# EasyEDA schematic SCH_FG Command Controller_2021-10-20.json
TITLE: ESQUEMA ELETRÔNICO PJ; REV: 1.0; Date: 2018-06-01; Sheet: 1/1; Drawn By: Rubens S e Marcos S
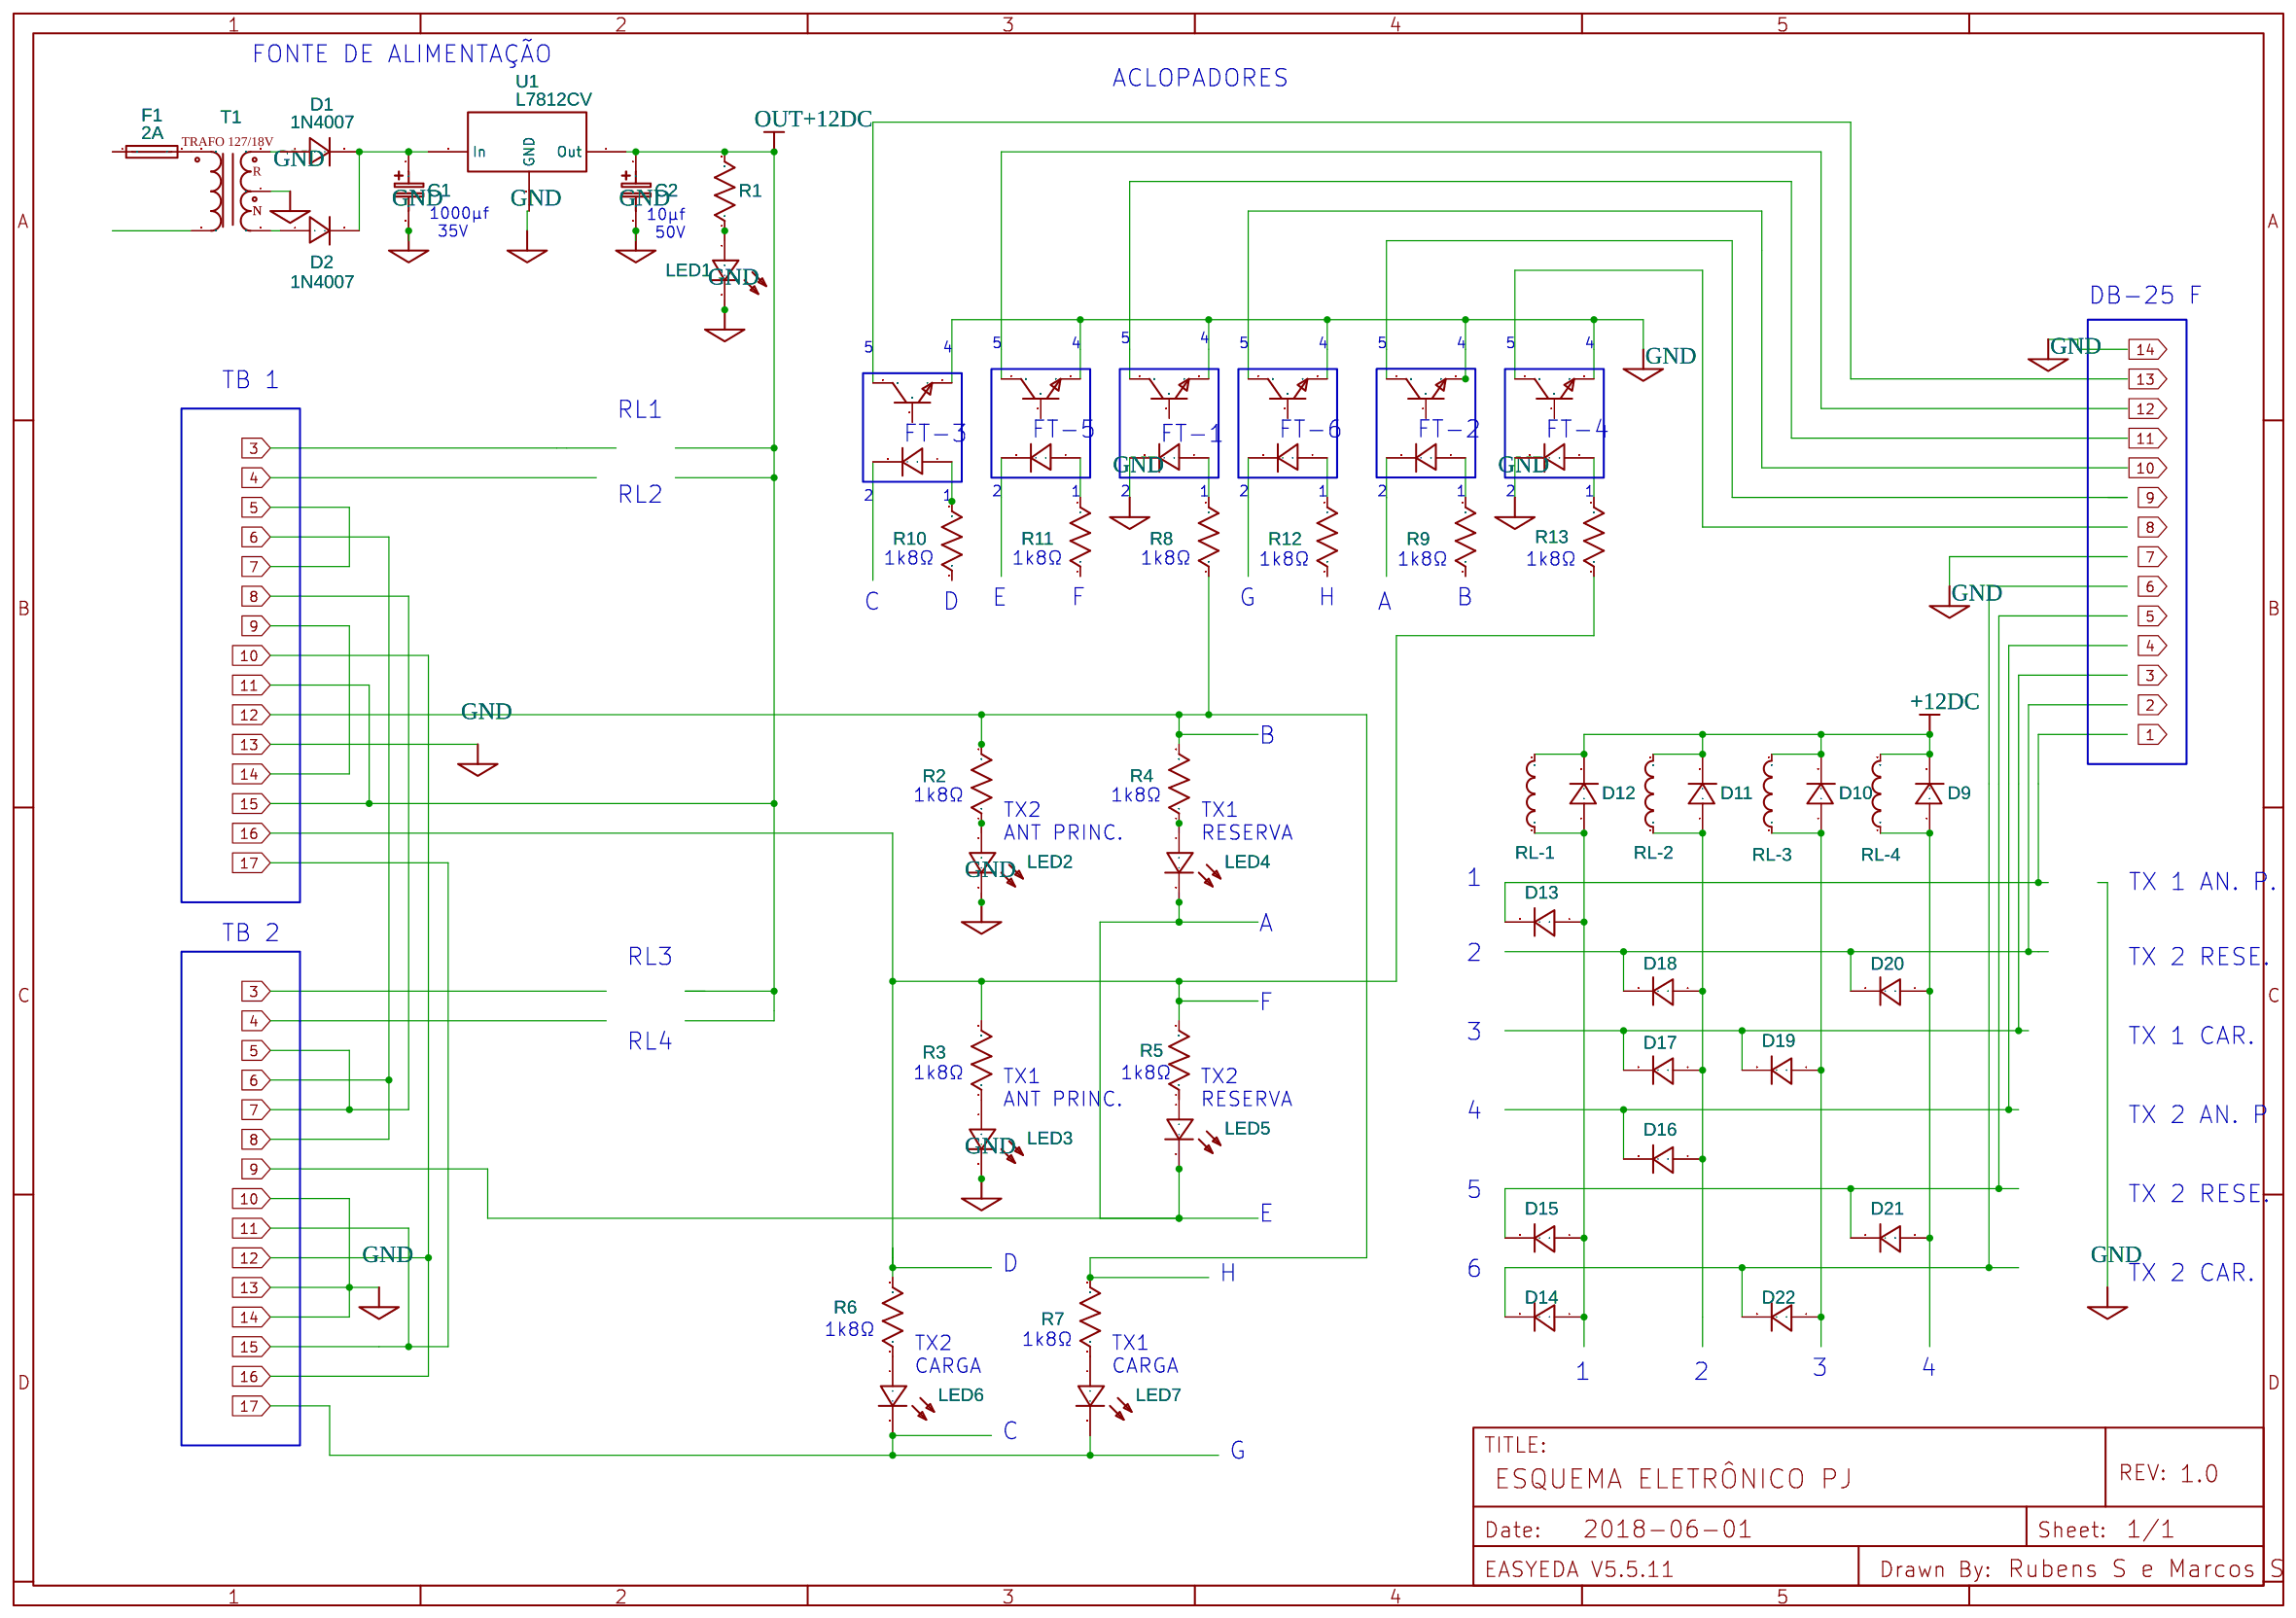
[diagram p0: schematic sheet]

## Parts
6  MMBT5551  [SOT-23(SOT-23-3)]
C1  1u  [CAP-D3.0XF1.5]
C2  1u  [CAP-D3.0XF1.5]
D1  1N4007  [DO35-10]
D2  1N4007  [DO35-10]
D3  1N4148  [DO35-10]
D4  1N4148  [DO35-10]
D5  1N4148  [DO35-10]
D6  1N4148  [DO35-10]
D7  1N4148  [DO35-10]
D8  1N4148  [DO35-10]
D9  1N4148  [DO35-10]
D10  1N4148  [DO35-10]
D11  1N4148  [DO35-10]
D12  1N4148  [DO35-10]
D13  1N4148  [DO35-10]
D14  1N4148  [DO35-10]
D15  1N4148  [DO35-10]
D16  1N4148  [DO35-10]
D17  1N4148  [DO35-10]
D18  1N4148  [DO35-10]
D19  1N4148  [DO35-10]
D20  1N4148  [DO35-10]
D21  1N4148  [DO35-10]
D22  1N4148  [DO35-10]
F1  2A  [2A-3F-250VAC]
LED1  LED 3MM  [LED-3MM/2.54]
LED2  NO  [LED-3MM/2.54]
LED3  LED 3MM  [LED-3MM/2.54]
LED4  LED 3MM  [LED-3MM/2.54]
LED5  LED 3MM  [LED-3MM/2.54]
LED6  LED 3MM  [LED-3MM/2.54]
LED7  LED 3MM  [LED-3MM/2.54]
Q1  MMBT5551  [SOT-23(SOT-23-3)]
Q3  MMBT5551  [SOT-23(SOT-23-3)]
Q4  MMBT5551  [SOT-23(SOT-23-3)]
Q5  MMBT5551  [SOT-23(SOT-23-3)]
Q6  MMBT5551  [SOT-23(SOT-23-3)]
R1  1k  [AXIAL-0.3]
R2  1k  [AXIAL-0.3]
R3  1k  [AXIAL-0.3]
R4  1k  [AXIAL-0.3]
R5  1k  [AXIAL-0.3]
R6  1k  [AXIAL-0.3]
R7  1k  [AXIAL-0.3]
R8  1k  [AXIAL-0.3]
R9  1k  [AXIAL-0.3]
R10  1k  [AXIAL-0.3]
R11  1k  [AXIAL-0.3]
R12  1k  [AXIAL-0.3]
R13  1k  [AXIAL-0.3]
RL-1  1m  [AXIAL-0.4]
RL-2  1m  [AXIAL-0.4]
RL-3  1m  [AXIAL-0.4]
RL-4  1m  [AXIAL-0.4]
T1  XFMR_TAP  [TRANSFORMER 2 TO 3]
U1  L7812CV  [SOT-223]

## Library data of the parts
6 Q1 Q3-Q6 = -: Supplier: LCSC; Manufacturer: CJ; image: http://image.lceda.cn/szlcsc/C28088.jpg; Supplier Part: C28088
C1 C2 = Capacitor: Manufacturer Part: ?
D1-D22 = -: Manufacturer Part: ?
F1 = -: Supplier: LCSC; Manufacturer Part: Glass tube fuse2A 3F 250VAC; Manufacturer: XCFuse; image: http://image.lceda.cn/szlcsc/C71017.jpg; Supplier Part: C71017
LED1-LED7 = -: Supplier: LCSC; Manufacturer: EVERLIGHT; Manufacturer Part: 204-10UYC/S530-A3
R1-R13 = Res_AXIAL-0.3(1/8W)_US: Manufacturer Part: ?
RL-1-RL-4 = Inductor: Manufacturer Part: ?
T1 = -: RATIO: 2; Manufacturer Part: ?
U1 = -: sourceId: dwIGgezVh; Supplier: LCSC; Manufacturer: AMS; Manufacturer Part: AMS1117-3.3; LCSC Assembly: Yes; image: http://image.lceda.cn/szlcsc/C6186.jpg; Supplier Part: C6186

## Nets
10: 6.3(E) C1.2 C2.2 D5.2(-) D8.2(-) LED1.2(-) LED2.2(-) LED3.2(-) LED4.2(-) LED5.2(-) Q1.3(E) Q3.3(E) Q4.3(E) Q5.3(E) Q6.3(E) R2.2 R3.2 R4.2 R5.2 R6.2 R7.2 R8.1 R13.1 T1.4 U1.1(GND)
11: C2.1 LED6.2(-) LED7.2(-) R1.2 U1.2(Out)
+12DC: D9.2(-) D10.2(-) D11.2(-) D12.2(-) RL-1.2 RL-2.2 RL-3.2 RL-4.2
Net-(C1-1): C1.1 D1.2(-) D2.2(-) U1.3(In)
Net-(D1-1): D1.1(+) T1.5
Net-(D2-1): D2.1(+) T1.3
Net-(D3-1): D3.1(+) R12.2
Net-(D4-1): D4.1(+) R11.2
Net-(D5-1): D5.1(+) R13.2
Net-(D6-1): D6.1(+) R10.2
Net-(D7-1): D7.1(+) R9.2
Net-(D8-1): D8.1(+) R8.2
Net-(D9-1): D9.1(+) D20.1(+) D21.1(+) RL-4.1
Net-(D10-1): D10.1(+) D19.1(+) D22.1(+) RL-3.1
Net-(D11-1): D11.1(+) D16.1(+) D17.1(+) D18.1(+) RL-2.1
Net-(D12-1): D12.1(+) D13.1(+) D14.1(+) D15.1(+) RL-1.1
Net-(D14-2): D14.2(-) D22.2(-)
Net-(D15-2): D15.2(-) D21.2(-)
Net-(D17-2): D17.2(-) D19.2(-)
Net-(D18-2): D18.2(-) D20.2(-)
Net-(F1-2): F1.2 T1.1
Net-(LED1-1): LED1.1(+) R1.1
Net-(LED2-1): LED2.1(+) R2.1
Net-(LED3-1): LED3.1(+) R3.1
Net-(LED4-1): LED4.1(+) R4.1
Net-(LED5-1): LED5.1(+) R5.1
Net-(LED6-1): LED6.1(+) R6.1
Net-(LED7-1): LED7.1(+) R7.1

Not connected (* = marked no-connect by the designer): 6 1(B) 2(C); D3 2(-); D4 2(-); D6 2(-); D7 2(-); D13 2(-); D16 2(-); F1 1; Q1 1(B) 2(C); Q3 1(B) 2(C); Q4 1(B) 2(C); Q5 1(B) 2(C); Q6 1(B) 2(C); R9 1; R10 1; R11 1; R12 1; T1 2

## Notes on the sheet
- FONTE DE ALIMENTAÇÃO
- ACLOPADORES
- 1000µf
   35V
- 10µf
   50V
- DB-25 F
- 5
- 4
- 5
- 4
- 5
- 4
- 5
- 4
- 5
- 4
- 5
- 4
- TB 1
- RL1
- FT-5
- FT-6
- FT-2
- FT-4
- FT-3
- FT-1
- RL2
- 2
- 1
- 2
- 1
- 2
- 1
- 2
- 1
- 2
- 1
- 2
- 1
- 1k8Ω
- 1k8Ω
- 1k8Ω
- 1k8Ω
- 1k8Ω
- 1k8Ω
- C
- D
- E
- F
- G
- H
- A
- B
- B
- 1k8Ω
- 1k8Ω
- TX2
  ANT PRINC.
- TX1
  RESERVA
- 1
- TX 1 AN. P.
- TB 2
- A
- RL3
- 2
- TX 2 RESE.
- F
- 3
- TX 1 CAR.
- RL4
- 1k8Ω
- TX1
  ANT PRINC.
- 1k8Ω
- TX2
  RESERVA
- 4
- TX 2 AN. P
- 5
- TX 2 RESE.
- E
- D
- 6
- H
- TX 2 CAR.
- 1k8Ω
- TX2
  CARGA
- 1k8Ω
- TX1
  CARGA
- 1
- 2
- 3
- 4
- C
- G
